# Altium schematic sheet Description+Errata.SchDoc: Description and Errata
size 279 x 215 mm; DrawnBy: Connor Dack; Engineer: Connor Dack; DocumentNumber: 1; Revision: 1.0; SheetNumber: 1; SheetTotal: 20
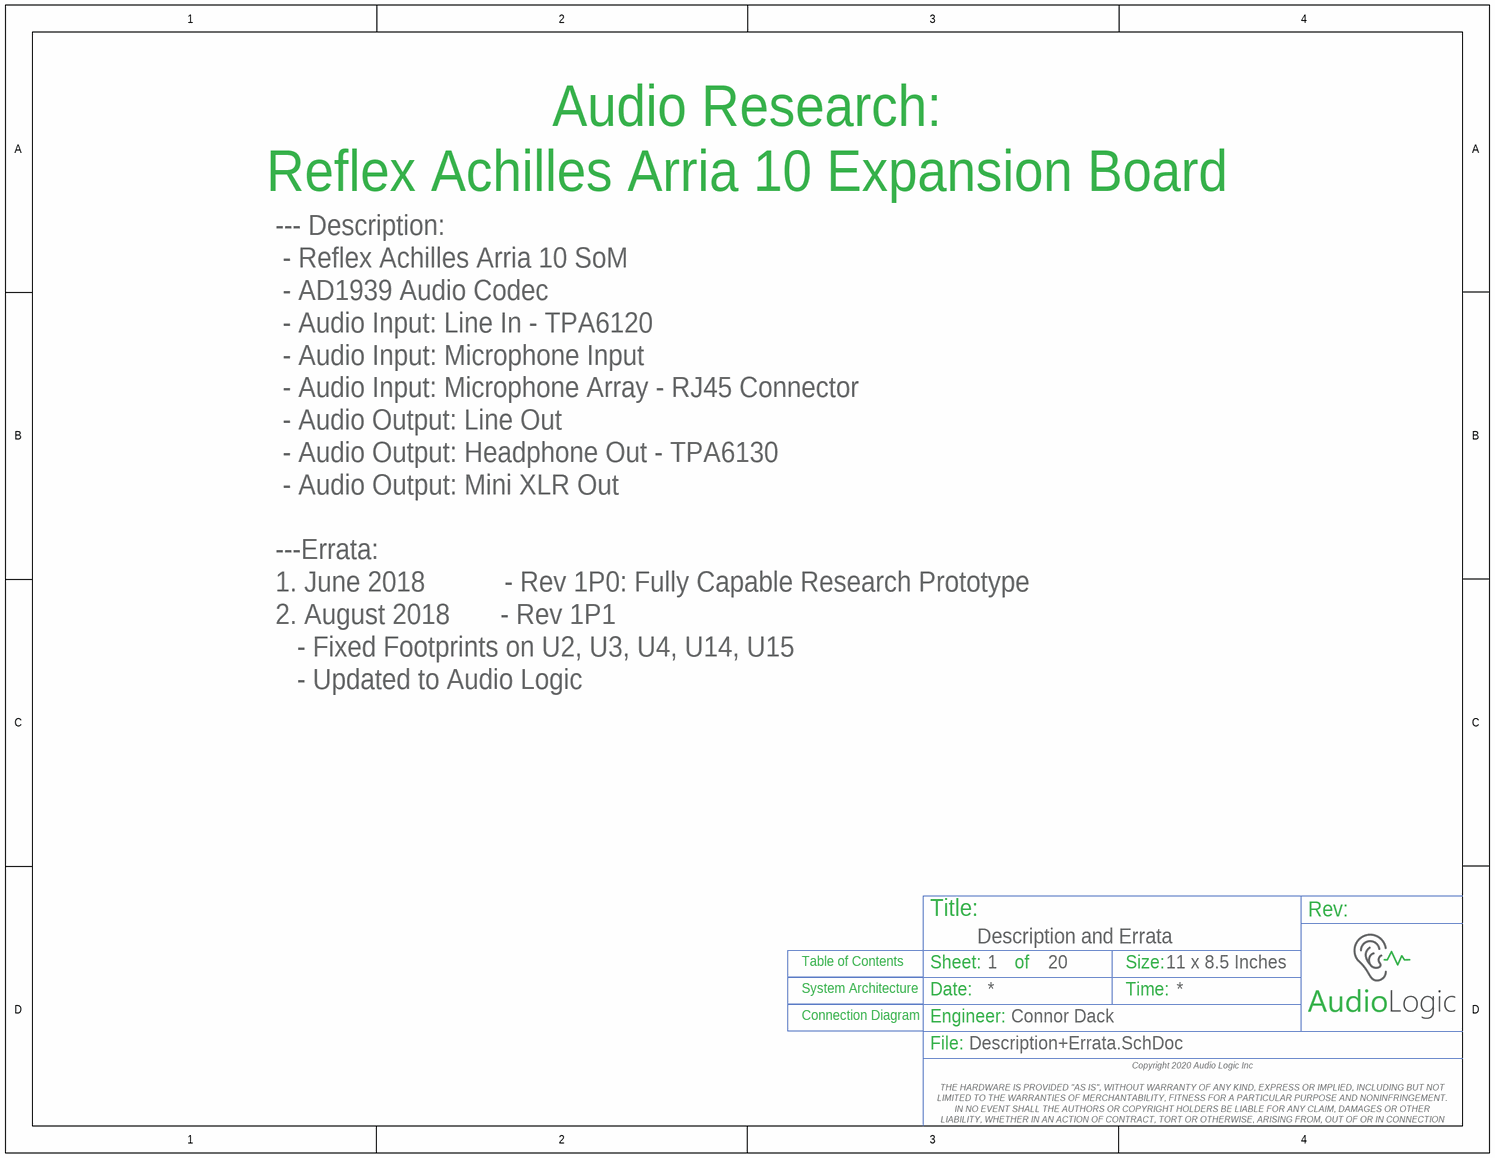
[diagram p0: Description+Errata.SchDoc]

## Sub-sheets
Connection Diagram = TopLevel.SchDoc: no entries
System Architecture = System_Architecture.SchDoc: no entries
Table of Contents = ToC.SchDoc: no entries

## Notes on the sheet
- Audio Research:
  Reflex Achilles Arria 10 Expansion Board
- --- Description:
  - Reflex Achilles Arria 10 SoM
  - AD1939 Audio Codec
  - Audio Input: Line In - TPA6120
  - Audio Input: Microphone Input
  - Audio Input: Microphone Array - RJ45 Connector
  - Audio Output: Line Out
  - Audio Output: Headphone Out - TPA6130
  - Audio Output: Mini XLR Out
  ---Errata:
  1. June 2018           - Rev 1P0: Fully Capable Research Prototype
  2. August 2018       - Rev 1P1
  - Fixed Footprints on U2, U3, U4, U14, U15
  - Updated to Audio Logic
- Title:
- Sheet:
- of
- Size:
- 11 x 8.5 Inches
- Rev:
- Date:
- Engineer:
- Time:
- File:
- Copyright 2020 Audio Logic Inc
  THE HARDWARE IS PROVIDED "AS IS", WITHOUT WARRANTY OF ANY KIND, EXPRESS OR IMPLIED, INCLUDING BUT NOT LIMITED TO THE WARRANTIES OF MERCHANTABILITY, FITNESS FOR A PARTICULAR PURPOSE AND NONINFRINGEMENT. IN NO EVENT SHALL THE AUTHORS OR COPYRIGHT HOLDERS BE LIABLE FOR ANY CLAIM, DAMAGES OR OTHER LIABILITY, WHETHER IN AN ACTION OF CONTRACT, TORT OR OTHERWISE, ARISING FROM, OUT OF OR IN CONNECTION WITH THE HARDWARE OR THE USE OR OTHER DEALINGS IN THE HARDWARE.